# Altium schematic sheet MCU.SchDoc
size A3
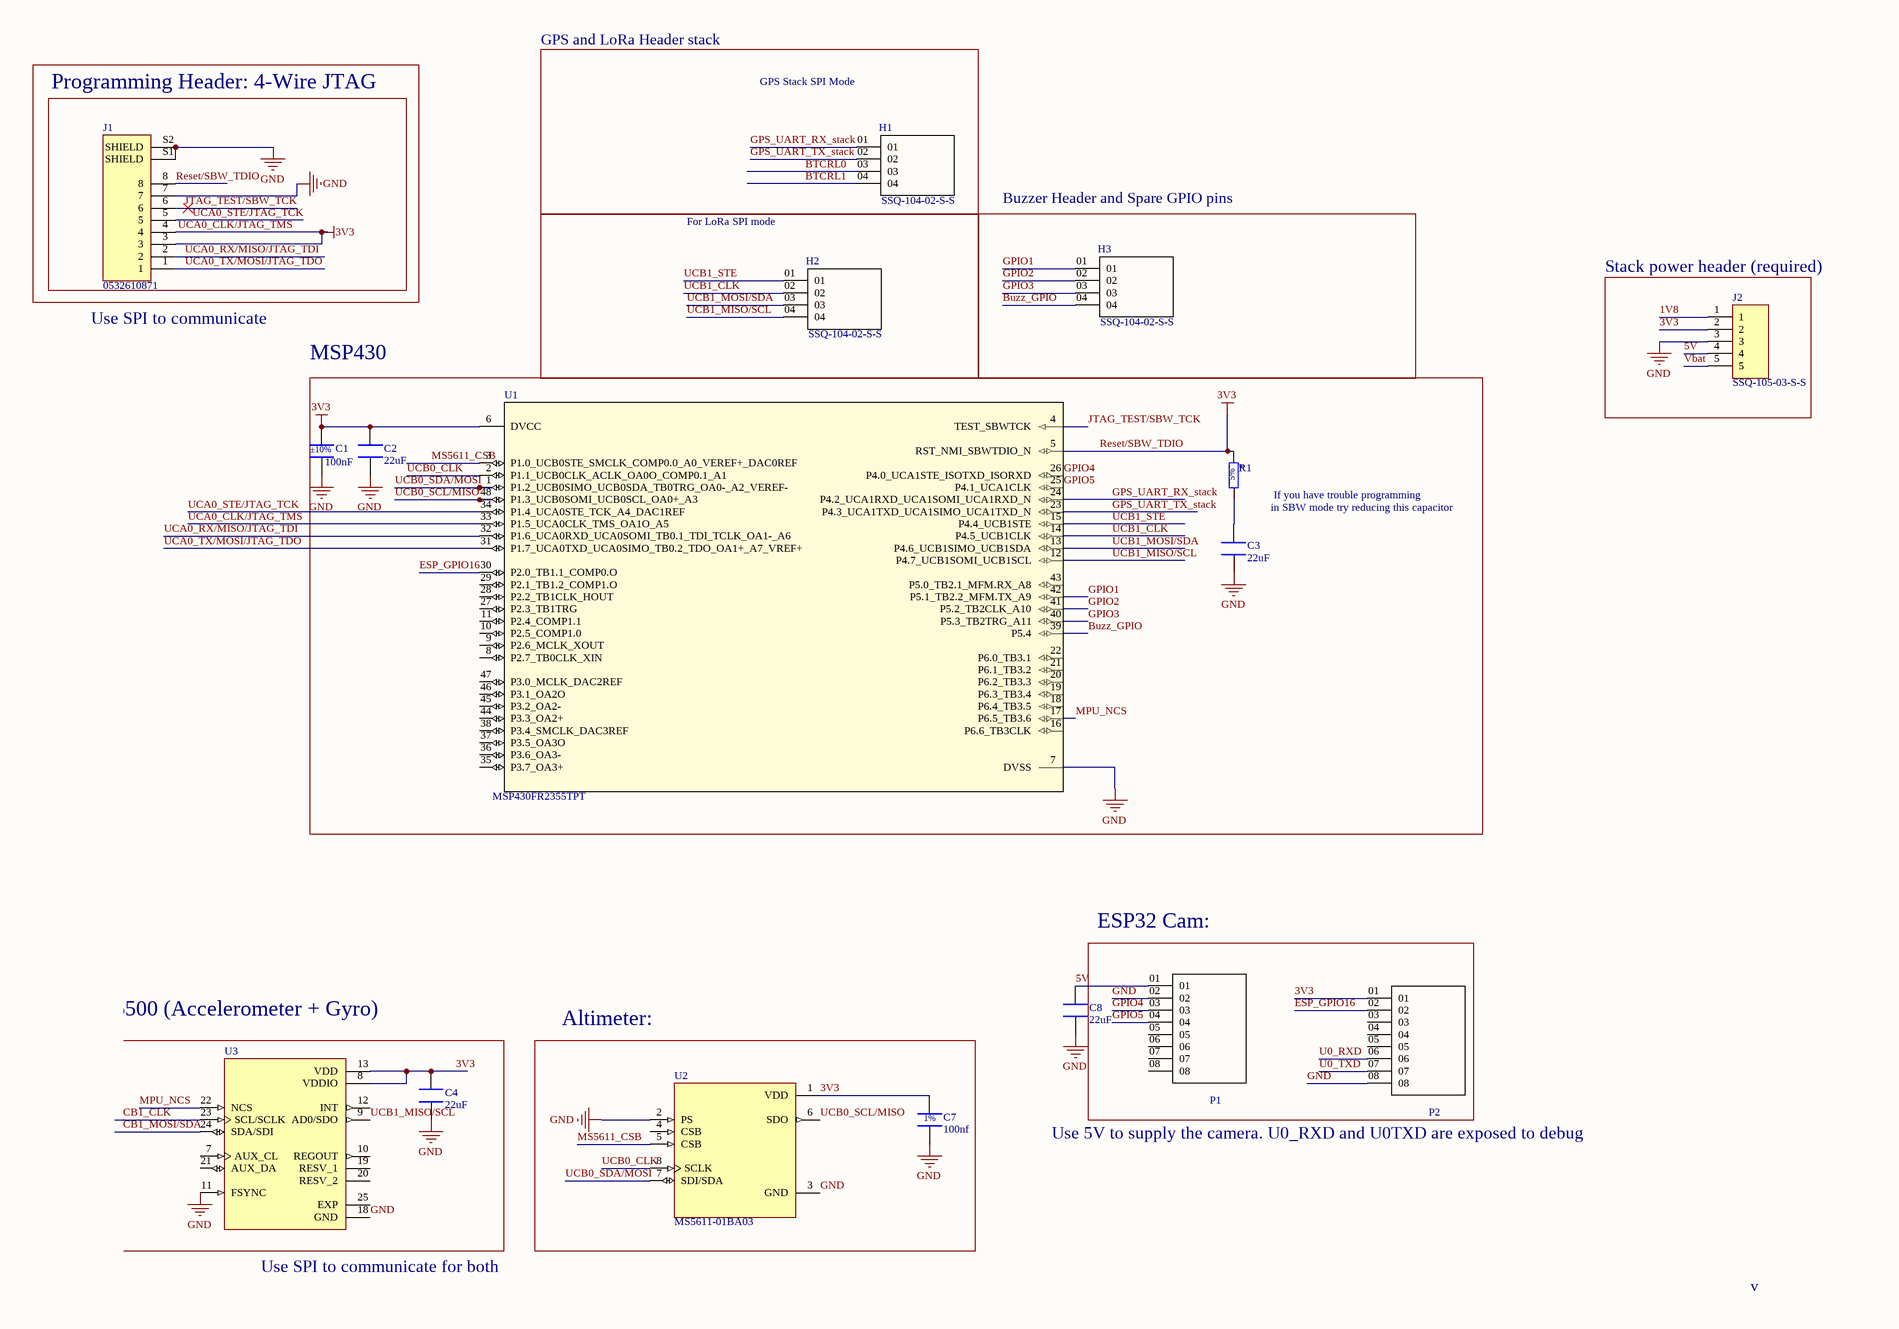
[diagram p0: MCU.SchDoc, left]
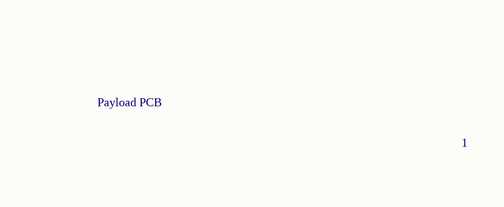
[diagram p1: MCU.SchDoc, right]

## Parts
C1  100nF  [CAPACITOR_0805_2012M-70N]
C2  22uF  [CAPACITOR_0805_2012M-70N]
C3  22uF  [CAPACITOR_0805_2012M-70N]
C4  22uF  [CAPACITOR_0805_2012M-70N]
C7  100nf  [CAPACITOR_0402_1005M_55N]
C8  22uF  [CAPACITOR_0805_2012M-70N]
H1  SSQ-104-02-S-S  [*SAMTEC_SSQ-104-02-S-S_SSQ-104-02-S-S(Primary)]  (no BOM)
H2  SSQ-104-02-S-S  [*SAMTEC_SSQ-104-02-S-S_SSQ-104-02-S-S(Primary)]  (no BOM)
H3  SSQ-104-02-S-S  [*SAMTEC_SSQ-104-02-S-S_SSQ-104-02-S-S(Primary)]  (no BOM)
J1  0532610871  [MOLEX_0532610871]
J2  SSQ-105-03-S-S  [SAMTEC_SSQ-105-03-S-S]
P1  SSQ-108-01-F-S-LL  [*SAMTEC_SSQ-108-01-F-S-LL_SSQ-108-01-F-S-LL(Primary)]  (value not drawn)
P2  SSQ-108-01-F-S-LL  [*SAMTEC_SSQ-108-01-F-S-LL_SSQ-108-01-F-S-LL(Primary)]  (value not drawn)
R1  *  [Resistor_0805_2012M-50N]
U1  MSP430FR2355TPT  [PT0048A_L]
U2  MS5611-01BA03  [SON125P500X300X100-8N]
U3  (no value)  [QFN40P300X300X95-25N]

## Blocks framed on the sheet
GPS and LoRa Header stack: H1
Programming Header: 4-Wire JTAG: J1
For LoRa SPI mode: H2
Buzzer Header and Spare GPIO pins: H3
Stack power header (required): J2
MSP430: C1-C3 R1 U1
ESP32 Cam:: P1 P2
Altimeter:: C7 U2

## Nets
3V3: C1.2 C2.2 C4.2 C7.2 J1.3 J1.4 J1.8 J2.2 P2.01 R1.2 U1.5(RST_NMI_SBWTDIO_N) U1.6(DVCC) U1.33(P1.5_UCA0CLK_TMS_OA1O_A5) U2.1(VDD) U3.8(VDDIO) U3.13(VDD)  [also labelled Reset/SBW_TDIO, UCA0_CLK/JTAG_TMS]
GND: C1.1 C2.1 C3.1 C4.1 C7.1 C8.1 J1.7 J1.S1(SHIELD) J1.S2(SHIELD) J2.3 P1.02 P2.08 U1.7(DVSS) U2.2(PS) U2.3(GND) U3.11(FSYNC) U3.18(GND)
1V8: J2.1
5V: C8.2 J2.4 P1.01
BTCRL0: H1.03
BTCRL1: H1.04
Buzz_GPIO: H3.04 U1.39(P5.4)
ESP_GPIO16: P2.02 U1.30(P2.0_TB1.1_COMP0.O)
GPIO1: H3.01 U1.42(P5.1_TB2.2_MFM.TX_A9)
GPIO2: H3.02 U1.41(P5.2_TB2CLK_A10)
GPIO3: H3.03 U1.40(P5.3_TB2TRG_A11)
GPIO4: P1.03 U1.26(P4.0_UCA1STE_ISOTXD_ISORXD)
GPIO5: P1.04 U1.25(P4.1_UCA1CLK)
GPS_UART_RX_stack: H1.01 U1.24(P4.2_UCA1RXD_UCA1SOMI_UCA1RXD_N)
GPS_UART_TX_stack: H1.02 U1.23(P4.3_UCA1TXD_UCA1SIMO_UCA1TXD_N)
JTAG_TEST/SBW_TCK: J1.6 U1.4(TEST_SBWTCK)
MPU_NCS: U1.17(P6.5_TB3.6) U3.22(NCS)
MS5611_CSB: U1.3(P1.0_UCB0STE_SMCLK_COMP0.0_A0_VEREF+_DAC0REF) U2.5(CSB)
U0_RXD: P2.06
U0_TXD: P2.07
UCA0_RX/MISO/JTAG_TDI: J1.2 U1.32(P1.6_UCA0RXD_UCA0SOMI_TB0.1_TDI_TCLK_OA1-_A6)
UCA0_STE/JTAG_TCK: J1.5 U1.34(P1.4_UCA0STE_TCK_A4_DAC1REF)
UCA0_TX/MOSI/JTAG_TDO: J1.1 U1.31(P1.7_UCA0TXD_UCA0SIMO_TB0.2_TDO_OA1+_A7_VREF+)
UCB0_CLK: U1.2(P1.1_UCB0CLK_ACLK_OA0O_COMP0.1_A1) U2.8(SCLK)
UCB0_SCL/MISO: U1.48(P1.3_UCB0SOMI_UCB0SCL_OA0+_A3) U2.6(SDO)
UCB0_SDA/MOSI: U1.1(P1.2_UCB0SIMO_UCB0SDA_TB0TRG_OA0-_A2_VEREF-) U2.7(SDI/SDA)
UCB1_CLK: H2.02 U1.14(P4.5_UCB1CLK) U3.23(SCL/SCLK)
UCB1_MISO/SCL: H2.04 U1.12(P4.7_UCB1SOMI_UCB1SCL) U3.9(AD0/SDO)
UCB1_MOSI/SDA: H2.03 U1.13(P4.6_UCB1SIMO_UCB1SDA) U3.24(SDA/SDI)
UCB1_STE: H2.01 U1.15(P4.4_UCB1STE)
Vbat: J2.5
NetC3_2: C3.2 R1.1

Not connected (* = marked no-connect by the designer): P1 05 06 07 08; P2 03 04 05; U1 8(P2.7_TB0CLK_XIN) 9(P2.6_MCLK_XOUT) 10(P2.5_COMP1.0) 11(P2.4_COMP1.1) 16(P6.6_TB3CLK) 18(P6.4_TB3.5) 19(P6.3_TB3.4) 20(P6.2_TB3.3) 21(P6.1_TB3.2) 22(P6.0_TB3.1) 27(P2.3_TB1TRG) 28(P2.2_TB1CLK_HOUT) 29(P2.1_TB1.2_COMP1.O) 35(P3.7_OA3+) 36(P3.6_OA3-) 37(P3.5_OA3O) 38(P3.4_SMCLK_DAC3REF) 43(P5.0_TB2.1_MFM.RX_A8) 44(P3.3_OA2+) 45(P3.2_OA2-) 46(P3.1_OA2O) 47(P3.0_MCLK_DAC2REF); U2 4(CSB); U3 7(AUX_CL) 10(REGOUT) 12(INT) 19(RESV_1) 20(RESV_2) 21(AUX_DA) 25(EXP)

## Notes on the sheet
- GPS Stack SPI Mode
- (near J1) Use SPI to communicate
- in SBW mode try reducing this capacitor
- If you have trouble programming
- MPU6500 (Accelerometer + Gyro)
- Use 5V to supply the camera. U0_RXD and U0TXD are exposed to debug
- Payload PCB
- (near U3) Use SPI to communicate for both
- v
- 1
- (in symbol GCM1555CxxxxxF Series) 1%

## Library data of the parts
C1 = Generic Capacitor: MF Part No.: C0805C104K5RAC7800; Tolerance: ±10%; Temperature Coefficient: X7R; Rated Voltage: 50V; Capacitance at Rated Voltage: 40%; Temp Range: -55°C ~ 125°C; Supplier 1: Digikey; Supplier 1 Part No.: 399-C0805C104K5RAC7800CT-ND; Package: 0805; Value: 100nF
C2-C4 C8 = C0805C226M9PACTU: Passive - Capacitor, X5R, 22uF Max, 6.3V, 0805 (2012 Metric), ±20%, -55°C ~ 85°C. 8.8uF @ 5V; APSS Standard Part: APSS Standard; Capacitance at Rated Voltage: 30%; Tolerance: ±20%; Temperature Coefficient: X5R; Rated Voltage: 6.3V; Temp Range: -55°C ~ 85°C; Package: 0805; Supplier 1: Digikey; Supplier 1 Part No.: 399-C0805C226M9PAC7800CT-ND; MF Part No.: C0805C226M9PACTU; Value: 22uF
C7 = GCM1555CxxxxxF Series: Passive - Capacitor Series, C0G, 5pF ~ 1nF, 50V, 0402 (1005 Metric), ±1%, -55°C ~ 125°C; APSS Standard Part: APSS Standard; Capacitance at Rated Voltage: 100%; E Series: E24; Tolerance: ±1%; Temperature Coefficient: C0G; Rated Voltage: 50V; Value Range: 5pF ~ 1nF; Temp Range: -55°C ~ 125°C; Supplier 1: Digikey; Package: 0402; Value: 100nf
J1 = 0532610871: Picoblade Connector, 8 Circuit Single Row, Right Angle Surface Mount SMT PCB; MF: Molex; Package: None; Price: None; Check_prices: https://www.snapeda.com/parts/0532610871/Molex/view-part/?ref=eda; Value: *; SnapEDA_Link: https://www.snapeda.com/parts/0532610871/Molex/view-part/?ref=snap; MP: 0532610871; Availability: In Stock; Purchase-URL: https://pricing.snapeda.com/search/part/0532610871/?ref=eda
J2 = SSQ-105-03-S-S: MF: {'manufacturer': u'Samtec Inc.'}; Package: None; Price: None; Value: *; MP: SSQ-105-03-S-S; Availability: Unavailable
R1 = RMCF0805JT Series: Passive - Resistor Series, 0805, 5%, 100m - 22M, E24, 0.063W, 1/16W, ±200ppm/°C, -55°C ~ 155°C, 0805 (2012 Metric); APSS Standard Part: APSS Standard; Power: 1/8W; Value Range: 100m ~ 22M; Rated Voltage: 150V; Tolerance: 5%; E Series: E24; Temp Range: -55°C ~ 155°C; Supplier 1: Digikey; Package: 0805; Temperature Coefficient: ±200ppm/°C; MF Part No.: *; Value: *
U1 = MSP430FR2355IPT: APSS Standard Part: APSS Standard; Rated Voltage: 1.8V ~ 3.6V; Temp Range: -40°C ~ 105°C (TA); MF Part No.: MSP430FR2355TPT; Package: LQFP-48; Supplier 1: Digikey; Supplier 1 Part No.: 296-50260-ND
U2 = MS5611-01BA03: Pressure Sensor 0.15PSI ~ 17.4PSI (1kPa ~ 120kPa) Absolute - 24 b 8-SMD; MF: TE Connectivity; Package: SMD-8 Measurement Specialties; Price: None; Value: *; SnapEDA_Link: https://www.snapeda.com/parts/MS5611-01BA03/TE+Connectivity+ALCOSWITCH+Switches/view-part/?ref=snap; MP: MS5611-01BA03; Availability: Not in stock; Check_prices: https://www.snapeda.com/parts/MS5611-01BA03/TE+Connectivity+ALCOSWITCH+Switches/view-part/?ref=eda
U3 = MPU-6500: MotionTracking Device Digital Output 1.8V 24-Pin QFN EP T/R; MF: TDK InvenSense; SnapEDA_Link: https://www.snapeda.com/parts/MPU-6500/TDK/view-part/?ref=snap; Package: QFN-24 TDK; Value: *; MP: MPU-6500; Check_prices: https://www.snapeda.com/parts/MPU-6500/TDK/view-part/?ref=eda
P1 P2 = SSQ-108-01-F-S-LL: SnapEDA_Link: https://www.snapeda.com/parts/SSQ-108-01-F-S-LL/Samtec/view-part/?ref=snap; Check_prices: https://www.snapeda.com/parts/SSQ-108-01-F-S-LL/Samtec/view-part/?ref=eda; Value: *